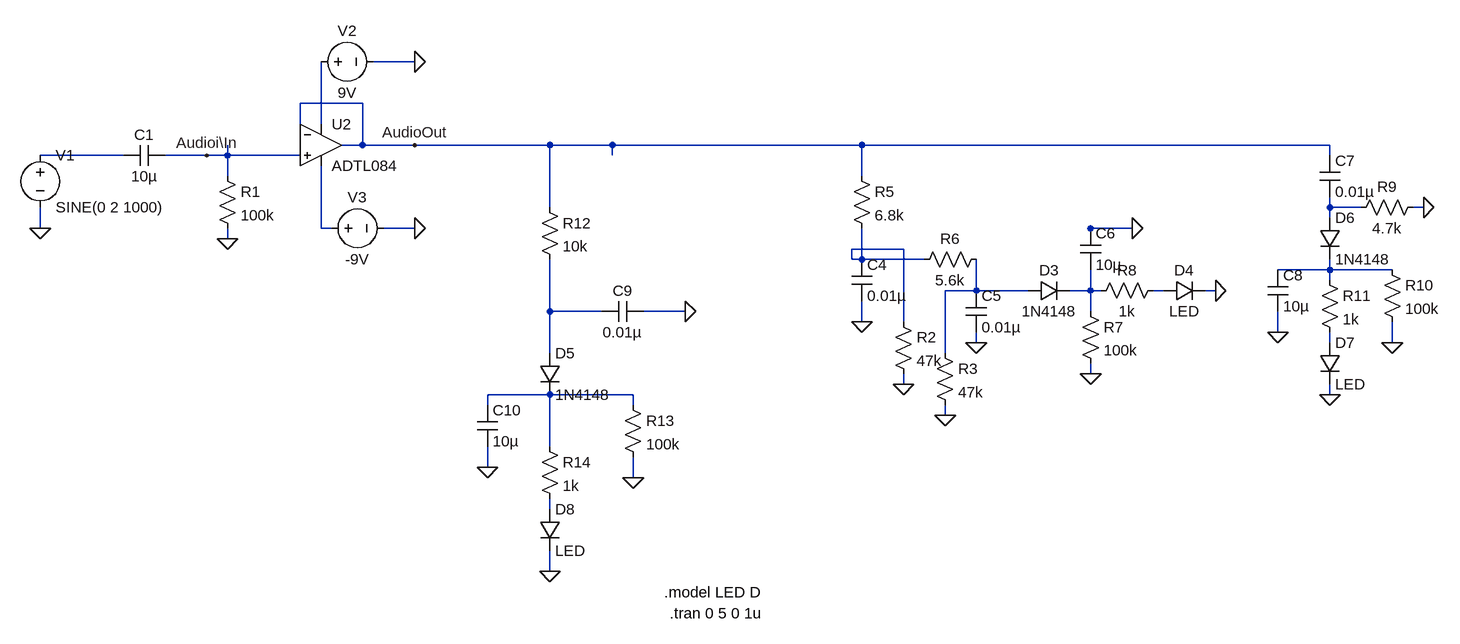
[diagram p0: schematic Audio.asc]
Audio.asc, the LTspice schematic file:
Version 4.1
SHEET 1 2932 1556
WIRE 880 48 816 48
WIRE 800 112 704 112
WIRE 736 144 736 48
WIRE 704 160 704 112
WIRE 800 176 800 112
WIRE 800 176 768 176
WIRE 880 176 800 176
WIRE 1088 176 880 176
WIRE 1184 176 1088 176
WIRE 1568 176 1184 176
WIRE 2288 176 1568 176
WIRE 432 192 304 192
WIRE 560 192 496 192
WIRE 592 192 592 176
WIRE 592 192 560 192
WIRE 704 192 592 192
WIRE 1184 192 1184 176
WIRE 2288 192 2288 176
WIRE 592 224 592 192
WIRE 1568 224 1568 176
WIRE 1088 272 1088 176
WIRE 2288 272 2288 256
WIRE 2336 272 2288 272
WIRE 2432 272 2416 272
WIRE 2288 288 2288 272
WIRE 304 304 304 272
WIRE 736 304 736 208
WIRE 752 304 736 304
WIRE 880 304 832 304
WIRE 1984 304 1920 304
WIRE 592 320 592 304
WIRE 1920 320 1920 304
WIRE 1632 336 1552 336
WIRE 1552 352 1552 336
WIRE 1568 352 1568 304
WIRE 1568 352 1552 352
WIRE 1664 352 1568 352
WIRE 2288 368 2288 352
WIRE 2288 368 2208 368
WIRE 2384 368 2288 368
WIRE 2288 384 2288 368
WIRE 1744 400 1744 352
WIRE 1744 400 1696 400
WIRE 1824 400 1744 400
WIRE 1920 400 1920 368
WIRE 1920 400 1888 400
WIRE 1936 400 1920 400
WIRE 2032 400 2016 400
WIRE 2112 400 2096 400
WIRE 1088 432 1088 352
WIRE 1168 432 1088 432
WIRE 1296 432 1232 432
WIRE 1920 432 1920 400
WIRE 1568 448 1568 416
WIRE 1632 448 1632 336
WIRE 2208 464 2208 432
WIRE 1744 480 1744 464
WIRE 2288 480 2288 464
WIRE 2384 480 2384 448
WIRE 1088 496 1088 432
WIRE 1696 496 1696 400
WIRE 1920 528 1920 512
WIRE 1632 544 1632 528
WIRE 1088 560 1088 544
WIRE 1088 560 992 560
WIRE 1216 560 1088 560
WIRE 2288 560 2288 544
WIRE 992 576 992 560
WIRE 1216 576 1216 560
WIRE 1696 592 1696 576
WIRE 1088 640 1088 560
WIRE 992 672 992 640
WIRE 1216 688 1216 656
WIRE 1088 736 1088 720
WIRE 1088 832 1088 800
FLAG 592 320 0
FLAG 304 304 0
FLAG 560 192 Audioi\In
FLAG 880 176 AudioOut
FLAG 880 304 0
FLAG 880 48 0
FLAG 1568 448 0
FLAG 1744 480 0
FLAG 1920 528 0
FLAG 1984 304 0
FLAG 2432 272 0
FLAG 2384 480 0
FLAG 2208 464 0
FLAG 2288 560 0
FLAG 2112 400 0
FLAG 1296 432 0
FLAG 992 672 0
FLAG 1216 688 0
FLAG 1088 832 0
FLAG 1632 544 0
FLAG 1696 592 0
SYMBOL cap 496 176 R90
WINDOW 0 0 32 VBottom 2
WINDOW 3 32 32 VTop 2
SYMATTR InstName C1
SYMATTR Value 10µ
SYMBOL res 576 208 R0
SYMATTR InstName R1
SYMATTR Value 100k
SYMBOL voltage 304 176 R0
WINDOW 123 0 0 Left 0
WINDOW 39 0 0 Left 0
SYMATTR InstName V1
SYMATTR Value SINE(0 2 1000)
SYMBOL OpAmps\\ADTL084 736 112 R0
SYMATTR InstName U2
SYMBOL voltage 720 48 R270
WINDOW 0 32 56 VTop 2
WINDOW 3 -32 56 VBottom 2
SYMATTR InstName V2
SYMATTR Value 9V
SYMBOL voltage 736 304 R270
WINDOW 0 32 56 VTop 2
WINDOW 3 -32 56 VBottom 2
SYMATTR InstName V3
SYMATTR Value -9V
SYMBOL res 1552 208 R0
SYMATTR InstName R5
SYMATTR Value 6.8k
SYMBOL res 1760 336 R90
WINDOW 0 0 56 VBottom 2
WINDOW 3 32 56 VTop 2
SYMATTR InstName R6
SYMATTR Value 5.6k
SYMBOL cap 1552 352 R0
SYMATTR InstName C4
SYMATTR Value 0.01µ
SYMBOL cap 1728 400 R0
SYMATTR InstName C5
SYMATTR Value 0.01µ
SYMBOL diode 1824 416 R270
WINDOW 0 32 32 VTop 2
WINDOW 3 0 32 VBottom 2
SYMATTR InstName D3
SYMATTR Value 1N4148
SYMBOL cap 1904 304 R0
SYMATTR InstName C6
SYMATTR Value 10µ
SYMBOL res 1904 416 R0
SYMATTR InstName R7
SYMATTR Value 100k
SYMBOL res 2032 384 R90
WINDOW 0 0 56 VBottom 2
WINDOW 3 32 56 VTop 2
SYMATTR InstName R8
SYMATTR Value 1k
SYMBOL diode 2032 416 R270
WINDOW 0 32 32 VTop 2
WINDOW 3 0 32 VBottom 2
SYMATTR InstName D4
SYMATTR Value LED
SYMBOL cap 2272 192 R0
SYMATTR InstName C7
SYMATTR Value 0.01µ
SYMBOL res 2432 256 R90
WINDOW 0 0 56 VBottom 2
WINDOW 3 32 56 VTop 2
SYMATTR InstName R9
SYMATTR Value 4.7k
SYMBOL diode 2272 288 R0
SYMATTR InstName D6
SYMATTR Value 1N4148
SYMBOL res 2368 352 R0
SYMATTR InstName R10
SYMATTR Value 100k
SYMBOL cap 2192 368 R0
SYMATTR InstName C8
SYMATTR Value 10µ
SYMBOL res 2272 368 R0
SYMATTR InstName R11
SYMATTR Value 1k
SYMBOL diode 2272 480 R0
SYMATTR InstName D7
SYMATTR Value LED
SYMBOL res 1072 256 R0
SYMATTR InstName R12
SYMATTR Value 10k
SYMBOL cap 1232 416 R90
WINDOW 0 0 32 VBottom 2
WINDOW 3 32 32 VTop 2
SYMATTR InstName C9
SYMATTR Value 0.01µ
SYMBOL diode 1072 496 R0
SYMATTR InstName D5
SYMATTR Value 1N4148
SYMBOL res 1200 560 R0
SYMATTR InstName R13
SYMATTR Value 100k
SYMBOL cap 976 576 R0
SYMATTR InstName C10
SYMATTR Value 10µ
SYMBOL res 1072 624 R0
SYMATTR InstName R14
SYMATTR Value 1k
SYMBOL diode 1072 736 R0
SYMATTR InstName D8
SYMATTR Value LED
SYMBOL res 1616 432 R0
SYMATTR InstName R2
SYMATTR Value 47k
SYMBOL res 1680 480 R0
SYMATTR InstName R3
SYMATTR Value 47k
TEXT 1264 864 Left 2 !.model LED D
TEXT 1272 896 Left 2 !.tran 0 5 0 1u

The netlist it stands for:
* Audio.asc
C1 Audioi\In N002 10µ
R1 Audioi\In 0 100k
V1 N002 0 SINE(0 2 1000)
X§U2 Audioi\In AudioOut N001 N004 AudioOut ADTL084  ; pins In+ In- V+ V- OUT
V2 N001 0 9V
V3 N004 0 -9V
R5 AudioOut N005 6.8k
R6 N007 N005 5.6k
C4 N005 0 0.01µ
C5 N007 0 0.01µ
D3 N007 N008 1N4148
C6 0 N008 10µ
R7 N008 0 100k
R8 N009 N008 1k
D4 N009 0 LED
C7 AudioOut N003 0.01µ
R9 0 N003 4.7k
D6 N003 N006 1N4148
R10 N006 0 100k
C8 N006 0 10µ
R11 N006 N011 1k
D7 N011 0 LED
R12 AudioOut N010 10k
C9 0 N010 0.01µ
D5 N010 N012 1N4148
R13 N012 0 100k
C10 N012 0 10µ
R14 N012 N013 1k
D8 N013 0 LED
R2 N005 0 47k
R3 N007 0 47k
.model D D
.lib standard.dio
.model LED D
.tran 0 5 0 1u
.lib ADTL084.lib
.backanno
.end